# EAGLE design untitled (EAGLE 6.6.0)
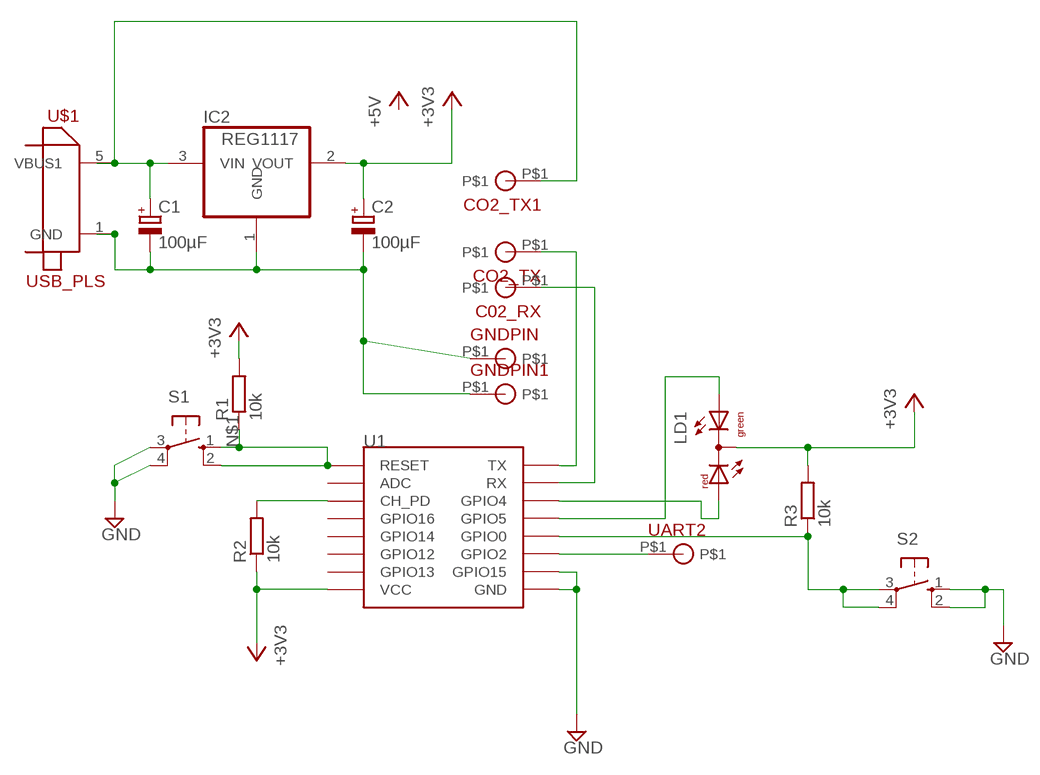
[diagram p0: schematic, sheet 1]

## Parts
C1  100µF  CPOL-EUE5-6  [E5-6]
C2  100µF  CPOL-EUE5-6  [E5-6]
C02_RX  1PIN  [1PIN]
CO2_TX  1PIN  [1PIN]
CO2_TX1  1PIN  [1PIN]
GNDPIN  1PIN  [1PIN]
GNDPIN1  1PIN  [1PIN]
IC2  REG1117  [SOT223]
LD1  DUOLED-RG-C  [DUOLED-C-5MM]
R1  10k  R-EU_R0603  [R0603]
R2  10k  R-EU_R0603  [R0603]
R3  10k  R-EU_R0603  [R0603]
S1  10-XX  [B3F-10XX]
S2  10-XX  [B3F-10XX]
U1  ESP12  [ESP12]
U$1  USB_PLS  [USB_PLB]
UART2  1PIN  [1PIN]

## Nets
+3V3: C2.+ IC2.2(VOUT) LD1.C R1.2 R2.1 R3.2 U1.VCC
+5V: C1.+ CO2_TX1.P$1 IC2.3(VIN) U$1.5(VBUS1)
GND: C1.- C2.- GNDPIN1.P$1 GNDPIN.P$1 IC2.1(GND) S1.3(P) S1.4(P1) S2.1(S) S2.2(S1) U1.GND U1.GPIO15 U$1.1(GND)
N$1: R1.1 S1.1(S) S1.2(S1) U1.RESET
N$2: R3.1 S2.3(P) S2.4(P1) U1.GPIO0
N$3: R2.2 U1.CH_PD
N$6: LD1.AX(AG) U1.GPIO5
N$7: LD1.AR U1.GPIO4
N$12: U1.GPIO2 UART2.P$1
RX: C02_RX.P$1 U1.RX
TX: CO2_TX.P$1 U1.TX
Unconnected: U1.ADC U1.GPIO12 U1.GPIO13 U1.GPIO14 U1.GPIO16

## Library data of the parts
C1 C2 = rcl:CPOL-EU: POLARIZED CAPACITOR, European symbol
C02_RX CO2_TX CO2_TX1 GNDPIN GNDPIN1 UART2 = 1PIN:1PIN
IC2 = burr-brown:REG1117: 800mA and 1A Low Dropout (LDO) Positive Regulator 1.8V, 2.5V, 2.85V, 3.3V, 5V, and Adj; MPN: REG1117; OC_FARNELL: 1097566; OC_NEWARK: 14P6981
LD1 = led:DUOLED-RG-C: DUO LED 2 colors (red/green), 5 mm, round, common Cathode www.ligitek.com or other producers.
R1-R3 = rcl:R-EU_: RESISTOR, European symbol
S1 S2 = switch-omron:10-XX: OMRON SWITCH; MPN: B3F-1000; OC_FARNELL: 176432; OC_NEWARK: 36M3542
U1 = esp8266modules:ESP12: ESP8266 Wifi module 12
U$1 = usb_platte:USB_PLS

## Board
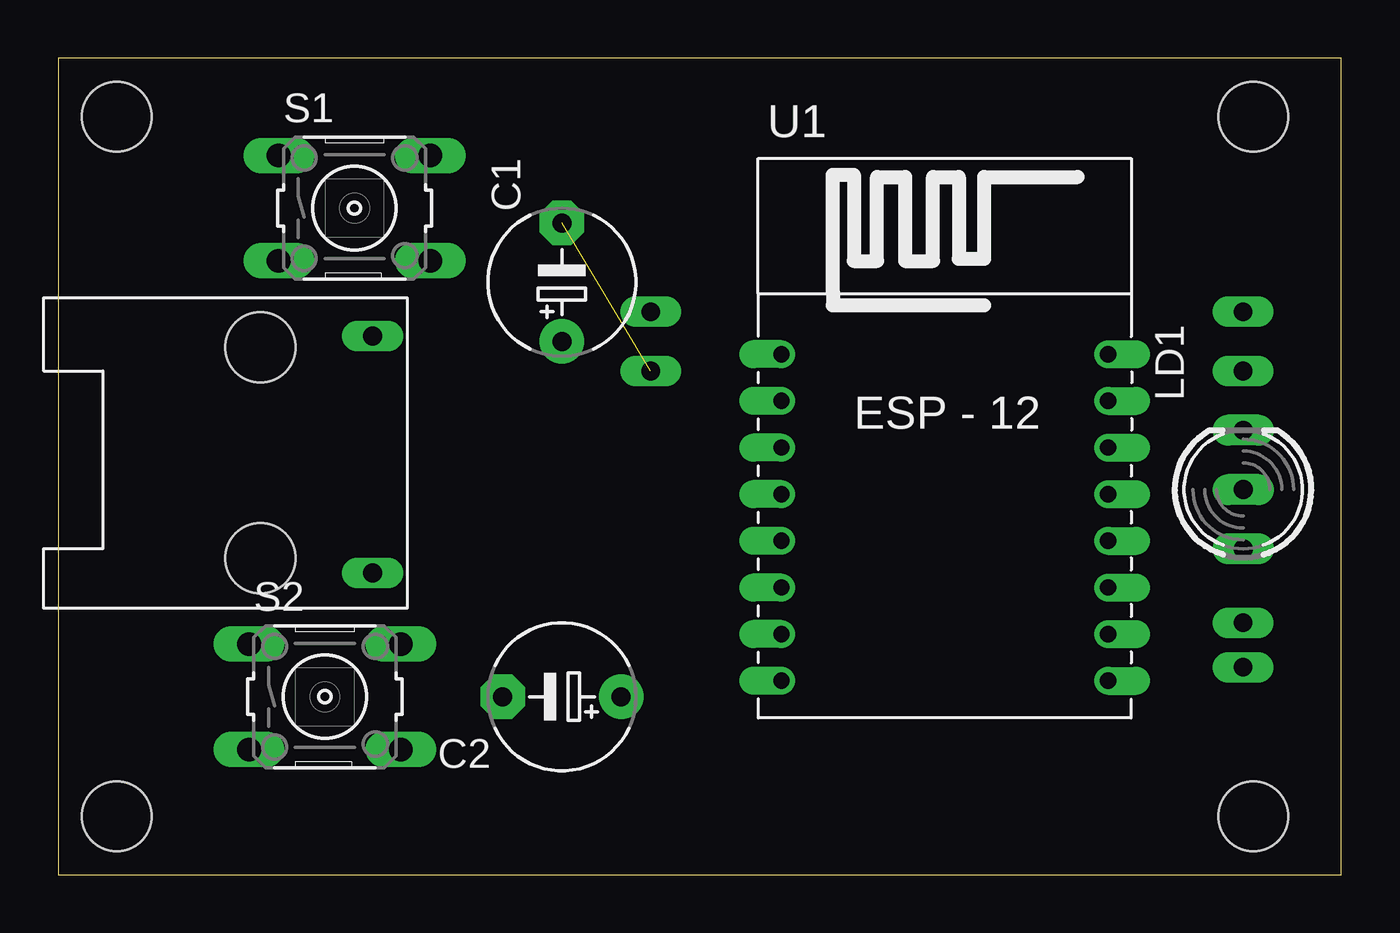
[diagram p1: board, top side]
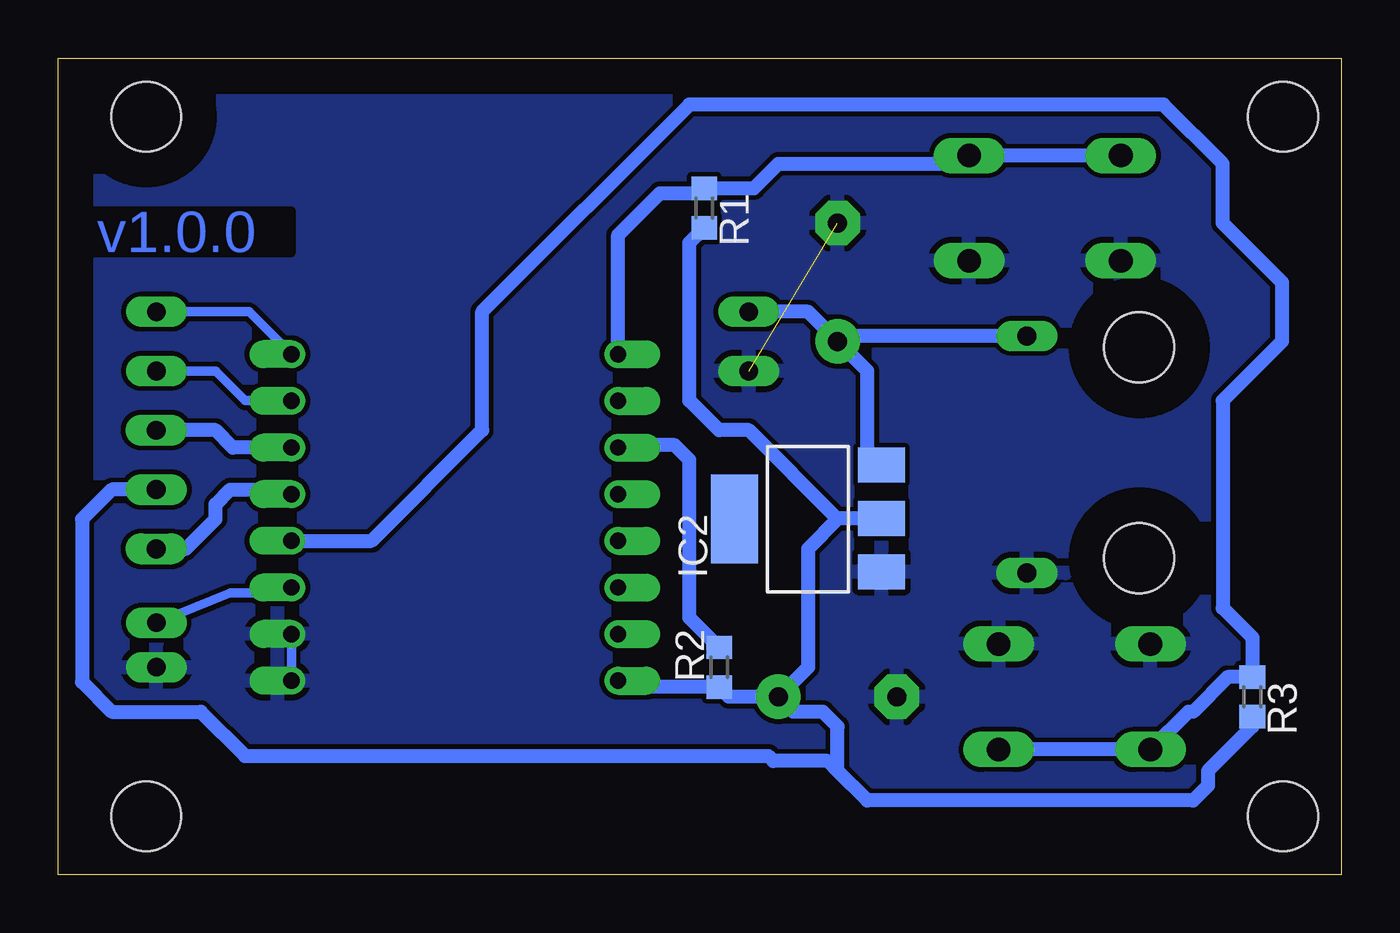
[diagram p2: board, bottom side, seen from below]

Size 55 x 35 mm. Coordinates in mm from the lower left corner, seen from the top.
Outline: 0,0 55,0 55,35 0,35 0,0
Copper layers (1*16): Top 0.035mm / dielectric 1.5mm / Bottom 0.035mm
Design rules "default *": minimum track width 10mil, minimum drill 24mil, track to track 8mil, track to pad 8mil, pad to pad 8mil, via to via 8mil, smd to smd 8mil, copper to edge 60mil, drill to drill 8mil, minimum pad ring 10mil, minimum via ring 8mil, stop-mask expansion 4mil, vias tented up to drill 0mil, thermal gap 10mil
Holes 3 mm at 2.5,2.5 2.5,32.5 51.23,32.5 51.23,2.5

### Footprints (pad centres in the part's own frame; a part is rotated, then mirrored left to right if it is on the bottom)
E5-6 = drill 0.813 pad 1.905: + -2.54,0 | drill 0.813 pad 1.905 octagon: - 2.54,0
1PIN = drill 0.8 long: P$1 0,0
SOT223 = smd 1.499 x 2.007: 1 -2.261,-3.15; 2 0.025,-3.15; 3 2.311,-3.15 | smd 3.81 x 2.007: 4 0,3.15
DUOLED-C-5MM = drill 0.813 long: AR 2.54,0; AX -2.54,0; C 0,0
R0603 = smd 1 x 1.1: 1 -0.85,0; 2 0.85,0
B3F-10XX = drill 1.016 long: 1 -3.251,2.261; 2 3.251,2.261; 3 -3.251,-2.261; 4 3.251,-2.261
ESP12 = drill 0.7 offset: ADC -7.1,3.8; CH_PD -7.1,1.8; GND 6.9,-8.2; GPIO0 6.9,-2.2; GPIO2 6.9,-4.2; GPIO4 6.9,1.8; GPIO5 6.9,-0.2; GPIO12 -7.1,-4.2; GPIO13 -7.1,-6.2; GPIO14 -7.1,-2.2; GPIO15 6.9,-6.2; GPIO16 -7.1,-0.2; RESET -7.1,5.8; RX 6.9,3.8; TX 6.9,5.8; VCC -7.1,-8.2
USB_PLB = drill 0.8 long: 1 14.11,1.5; 5 14.11,11.66 | hole 3: 9.296,11.176; 9.296,2.134

### Placement (x,y rotation side)
C1  21.59,25.4 90 top
C2  21.59,7.62 180 top
C02_RX  50.8,21.59 0 top
CO2_TX  50.8,24.13 0 top
CO2_TX1  25.4,24.13 0 top
GNDPIN  25.4,21.59 0 top
GNDPIN1  50.8,8.89 0 top
IC2  22.86,15.24 90 bottom
LD1  50.8,16.51 90 top
R1  27.3,28.57 270 bottom
R2  26.67,8.89 90 bottom
R3  3.81,7.62 270 bottom
S1  12.7,28.57 0 top
S2  11.43,7.62 0 top
U1  38.1,16.51 0 top
U$1  -0.64,11.43 0 top
UART2  50.8,10.79 0 top

### Tracks (layer width: path | path; a pad name or v marks a point on that pad's centre or on a via)
+3V3
  Bottom 0.61: IC2.2 21.57,15.27 | 21.57,15.27 22.86,13.97 22.86,8.89 C2.+ | 21.57,15.27 21.61,15.27 25.4,19.05 26.67,19.05 27.94,20.32 27.94,27.09 R1.2 | R3.2 3.81,6.35 5.71,4.45 5.71,3.81 6.35,3.17 20.32,3.17 21.59,4.45 | 21.59,4.45 21.59,6.35 22.23,6.99 23.5,6.99 C2.+ | C2.+ 26.25,7.62 R2.1 30.73,8.04 U1.VCC | 21.59,4.45 22.01,4.87 24.34,4.87 24.56,5.08 46.99,5.08 48.9,6.99 52.7,6.99 53.98,8.26 53.98,15.24 52.7,16.51 LD1.C
+5V
  Bottom 0.61: IC2.3 20.32,18.16 20.32,21.59 C1.+ | C1.+ 21.36,23.09 U$1.5 | C1.+ 22.86,24.13 CO2_TX1.P$1
GND  (1 unrouted)
  Bottom 0.406: U1.GPIO15 U1.GND
  pour Bottom: 0,0 55.88,0 55.88,35.56 0,35.56
N$1
  Bottom 0.61: U1.RESET 31,27.42 29.21,29.21 27.52,29.21 R1.1 25.18,29.43 24.13,30.48 14.96,30.48 S1.2 S1.1
N$2
  Bottom 0.61: U1.GPIO0 41.57,14.31 36.83,19.05 36.83,24.13 27.94,33.02 7.62,33.02 5.08,30.48 5.08,27.94 2.54,25.4 2.54,22.86 5.08,20.32 5.08,11.43 3.81,10.16 R3.1 4.87,8.47 6.35,6.99 6.55,6.99 S2.3 S2.4
N$3
  Bottom 0.61: U1.CH_PD 30.89,18.41 28.57,18.41 27.94,17.78 27.94,11.01 R2.2
N$6
  Bottom 0.61: LD1.AX 49.53,13.97 48.26,15.24 48.26,15.88 47.62,16.51 45.2,16.51 U1.GPIO5
N$7
  Bottom 0.61: U1.GPIO4 47.52,18.31 48.26,19.05 LD1.AR
N$12
  Bottom 0.406: UART2.P$1 47.62,12.06 45.24,12.06 U1.GPIO2
RX
  Bottom 0.406: C02_RX.P$1 48.26,21.59 46.99,20.32 U1.RX
TX
  Bottom 0.406: CO2_TX.P$1 46.82,24.13 U1.TX

### Text on the board
Bottom: v1.0.0 | R